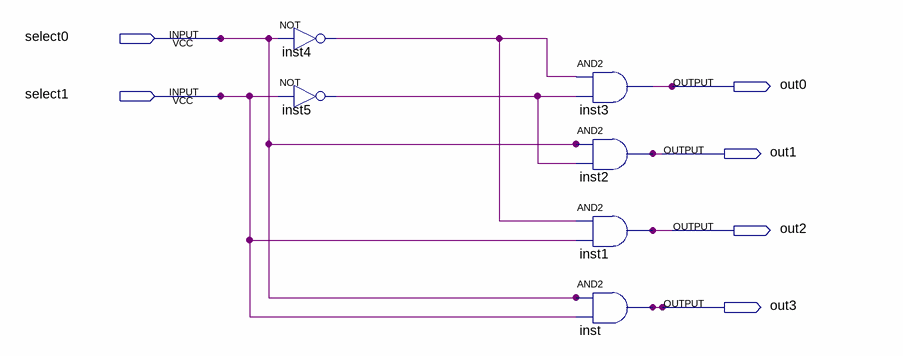
[diagram p0: schematic sheet]
// Quartus schematic decoder2to4 (2).bdf as structural Verilog: 6 symbols, 6 pins
module \decoder2to4_(2)  (
  input  select0,
  input  select1,
  output out0,
  output out1,
  output out2,
  output out3
);

  wire inst4_out, inst5_out;

  not inst4 (inst4_out, select0);
  not inst5 (inst5_out, select1);
  and inst3 (out0, inst4_out, inst5_out);
  and inst2 (out1, select0, inst5_out);
  and inst1 (out2, inst4_out, select1);
  and inst (out3, select0, select1);
endmodule
